# Altium schematic sheet LeftInterface.SchDoc
size A4
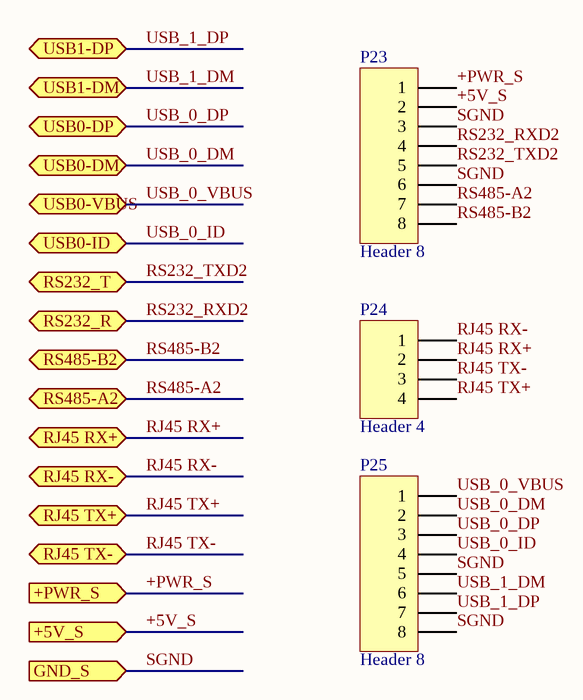
[diagram p0: LeftInterface.SchDoc]

## Parts
P23  Header 8  [DS1X8-2.54]
P24  Header 4  [DS1X4-2.54]
P25  Header 8  [DS1X8-2.54]

## Ports
+5V_S (in), +PWR_S (in), GND_S (in), RJ45 RX+ (bidir), RJ45 RX- (bidir), RJ45 TX+ (bidir), RJ45 TX- (bidir), RS232_R (bidir), RS232_T (bidir), RS485-A2 (bidir), RS485-B2 (bidir), USB0-DM (bidir), USB0-DP (bidir), USB0-ID (bidir), USB0-VBUS (bidir), USB1-DM (bidir), USB1-DP (bidir)

## Nets
+5V_S: P23.2 ; port +5V_S
+PWR_S: P23.1 ; port +PWR_S
RJ45 RX+: P24.2 ; port RJ45 RX+
RJ45 RX-: P24.1 ; port RJ45 RX-
RJ45 TX+: P24.4 ; port RJ45 TX+
RJ45 TX-: P24.3 ; port RJ45 TX-
RS232_RXD2: P23.4 ; port RS232_R
RS232_TXD2: P23.5 ; port RS232_T
RS485-A2: P23.7 ; port RS485-A2
RS485-B2: P23.8 ; port RS485-B2
SGND: P23.3 P23.6 P25.5 P25.8 ; port GND_S
USB_0_DM: P25.2 ; port USB0-DM
USB_0_DP: P25.3 ; port USB0-DP
USB_0_ID: P25.4 ; port USB0-ID
USB_0_VBUS: P25.1 ; port USB0-VBUS
USB_1_DM: P25.6 ; port USB1-DM
USB_1_DP: P25.7 ; port USB1-DP

## Library data of the parts
P23 P25 = Header 8: Header, 8-Pin; LatestRevisionDate: 17-Jul-2002; LatestRevisionNote: Re-released for DXP Platform.; Publisher: Altium Limited
P24 = Header 4: Header, 4-Pin; LatestRevisionDate: 17-Jul-2002; LatestRevisionNote: Re-released for DXP Platform.; Publisher: Altium Limited